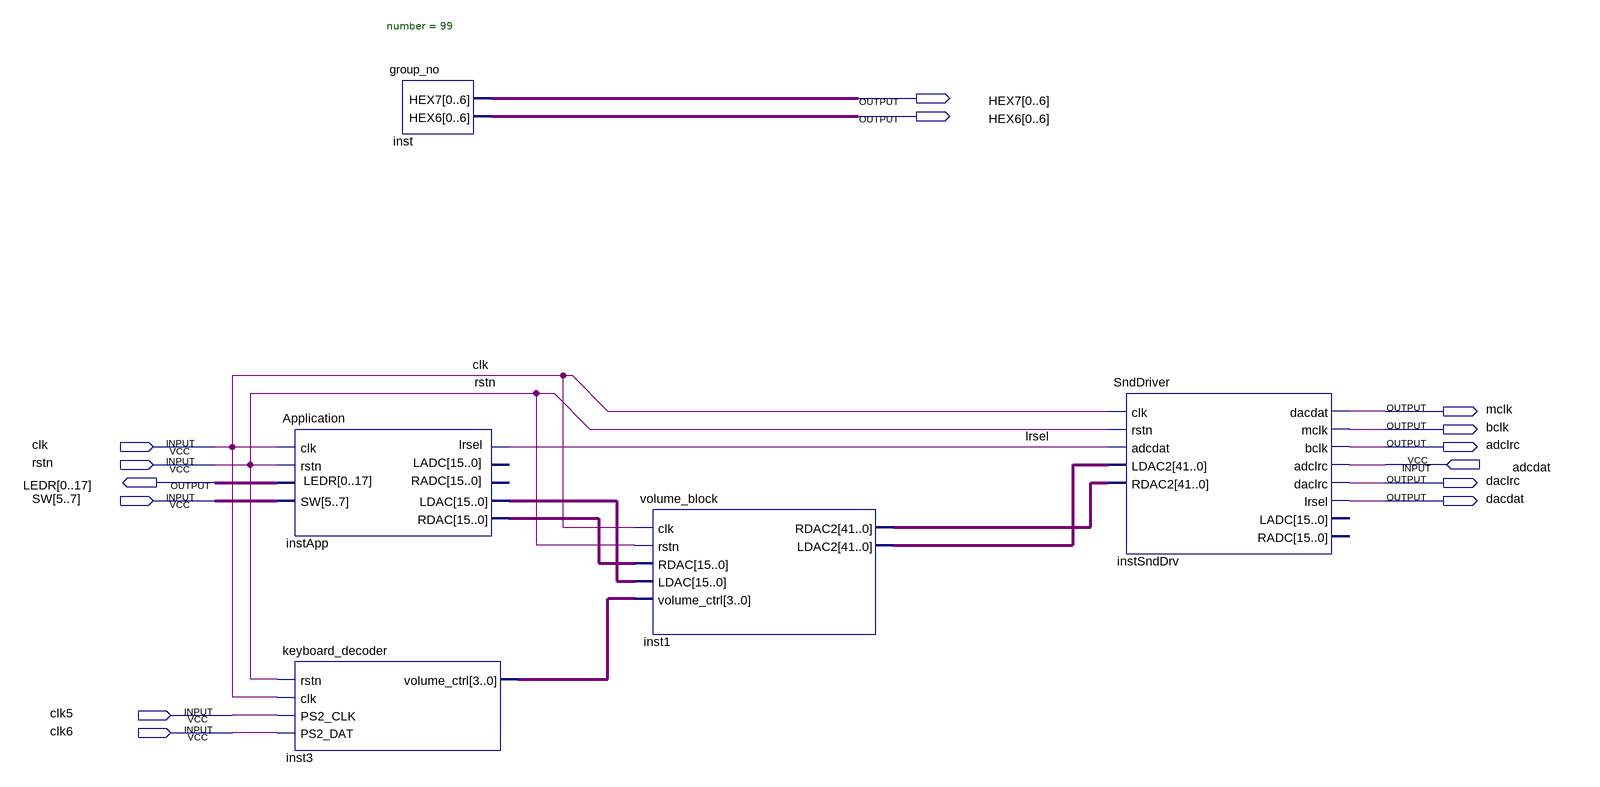
[diagram p0: schematic sheet]
// Quartus schematic Sound.bdf as structural Verilog: 5 symbols, 14 pins
module Sound (
  input  clk,
  input  rstn,
  input  adcdat,
  input  [5:7] SW,
  input  clk5,
  input  clk6,
  output [0:6] HEX7,
  output [0:6] HEX6,
  output mclk,
  output bclk,
  output adclrc,
  output [0:17] LEDR,
  output daclrc,
  output dacdat
);

  wire lrsel;
  wire [3:0] inst3_volume_ctrl;
  wire [15:0] instApp_ldac, instApp_rdac;
  wire [41:0] inst1_ldac2, inst1_rdac2;

  Application instApp (
    .clk(clk), .rstn(rstn), .SW(SW), .lrsel(lrsel), .LEDR(LEDR), .LDAC(instApp_ldac), .RDAC(instApp_rdac));  // open: LADC, RADC
  keyboard_decoder inst3 (.rstn(rstn), .clk(clk), .PS2_CLK(clk5), .PS2_DAT(clk6), .volume_ctrl(inst3_volume_ctrl));
  group_no #(.number(99)) inst (.HEX7(HEX7), .HEX6(HEX6));
  volume_block inst1 (
    .clk(clk), .rstn(rstn), .RDAC(instApp_rdac), .LDAC(instApp_ldac), .volume_ctrl(inst3_volume_ctrl),
    .RDAC2(inst1_rdac2), .LDAC2(inst1_ldac2));
  SndDriver instSndDrv (
    .clk(clk), .rstn(rstn), .adcdat(lrsel), .LDAC2(inst1_ldac2), .RDAC2(inst1_rdac2), .dacdat(mclk),
    .mclk(bclk), .bclk(adclrc), .adclrc(adcdat), .daclrc(daclrc), .lrsel(dacdat));  // open: LADC, RADC
endmodule
